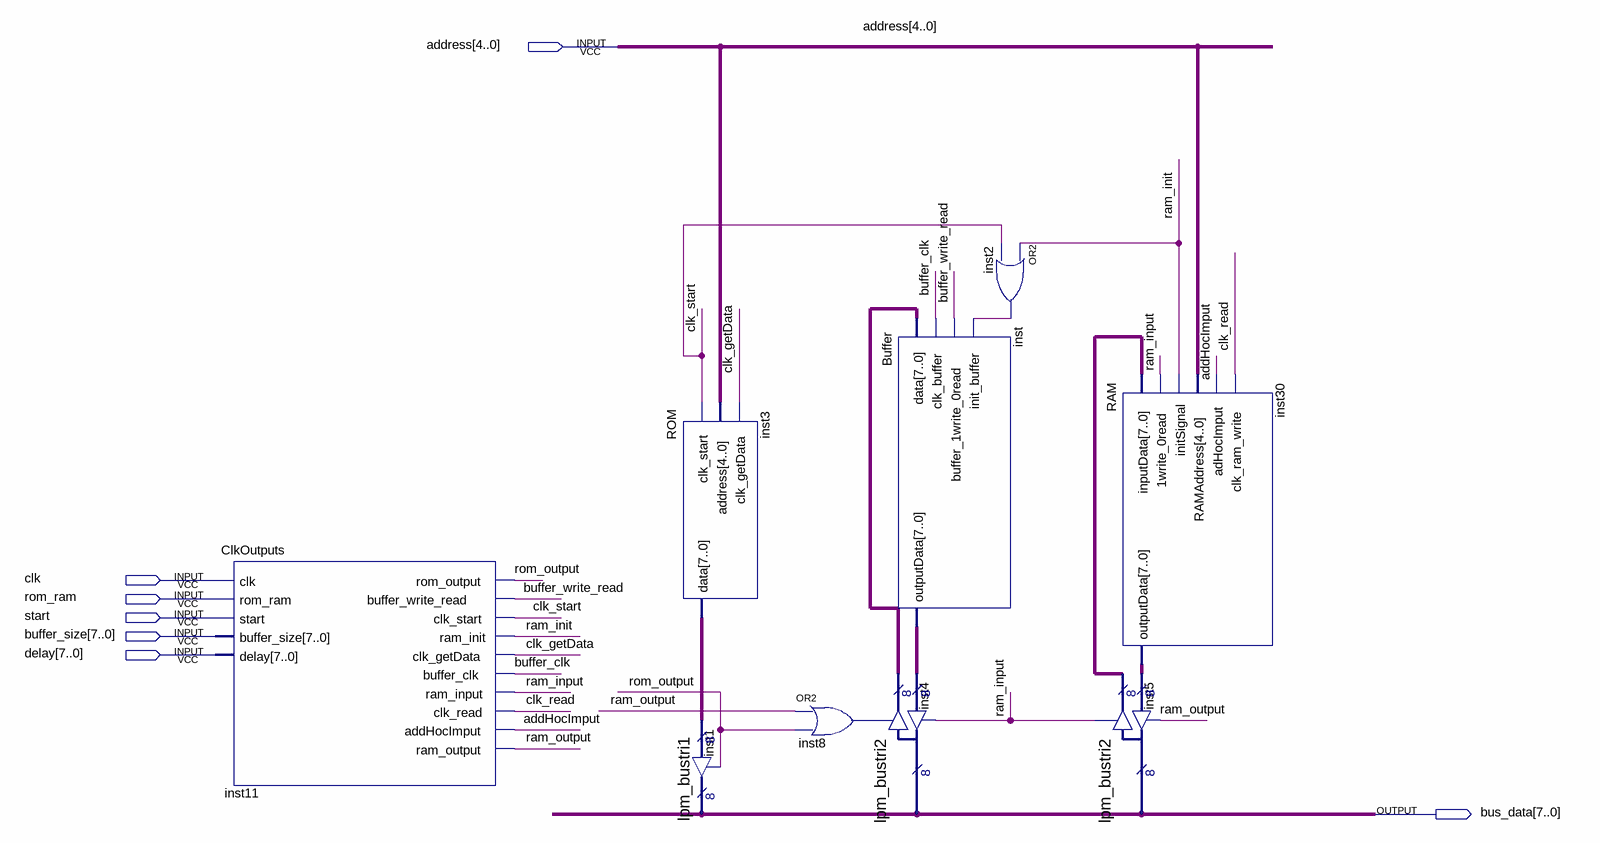
[diagram p0: schematic sheet]
// Quartus schematic Lab_3.bdf as structural Verilog: 9 symbols, 7 pins
module Lab_3 (
  input  [4:0] address,
  input  clk,
  input  rom_ram,
  input  start,
  input  [7:0] buffer_size,
  input  [7:0] delay,
  output [7:0] bus_data
);

  wire addHocImput, buffer_clk, buffer_write_read, clk_getData, clk_read, clk_start, inst2_out, inst8_out,
       ram_init, ram_input, ram_output, rom_output;
  wire [7:0] inst3_data, inst4_result, inst5_result, inst30_outputdata, inst_outputdata;

  ClkOutputs inst11 (
    .clk(clk), .rom_ram(rom_ram), .start(start), .buffer_size(buffer_size), .delay(delay),
    .rom_output(rom_output), .buffer_write_read(buffer_write_read), .clk_start(clk_start),
    .ram_init(ram_init), .clk_getData(clk_getData), .buffer_clk(buffer_clk), .ram_input(ram_input),
    .clk_read(clk_read), .addHocImput(addHocImput), .ram_output(ram_output));
  ROM inst3 (.clk_start(clk_start), .address(address), .clk_getData(clk_getData), .data(inst3_data));
  lpm_bustri1 inst1 (.enabledt(rom_output), .data(inst3_data), .tridata(bus_data));
  or inst8 (inst8_out, ram_output, rom_output);
  Buffer inst (
    .data(inst4_result), .clk_buffer(buffer_clk), .buffer_1write_0read(buffer_write_read),
    .init_buffer(inst2_out), .outputData(inst_outputdata));
  lpm_bustri2 inst4 (
    .enabledt(ram_input), .data(inst_outputdata), .enabletr(inst8_out), .result(inst4_result),
    .tridata(bus_data));
  or inst2 (inst2_out, ram_init, clk_start);
  RAM inst30 (
    .inputData(inst5_result), .\1write_0read (ram_input), .initSignal(ram_init), .RAMAddress(address),
    .adHocImput(addHocImput), .clk_ram_write(clk_read), .outputData(inst30_outputdata));
  lpm_bustri2 inst5 (
    .enabledt(ram_output), .data(inst30_outputdata), .enabletr(ram_input), .result(inst5_result),
    .tridata(bus_data));
endmodule
